# EAGLE design BLE-LORA-Relay (EAGLE 8.6.0)
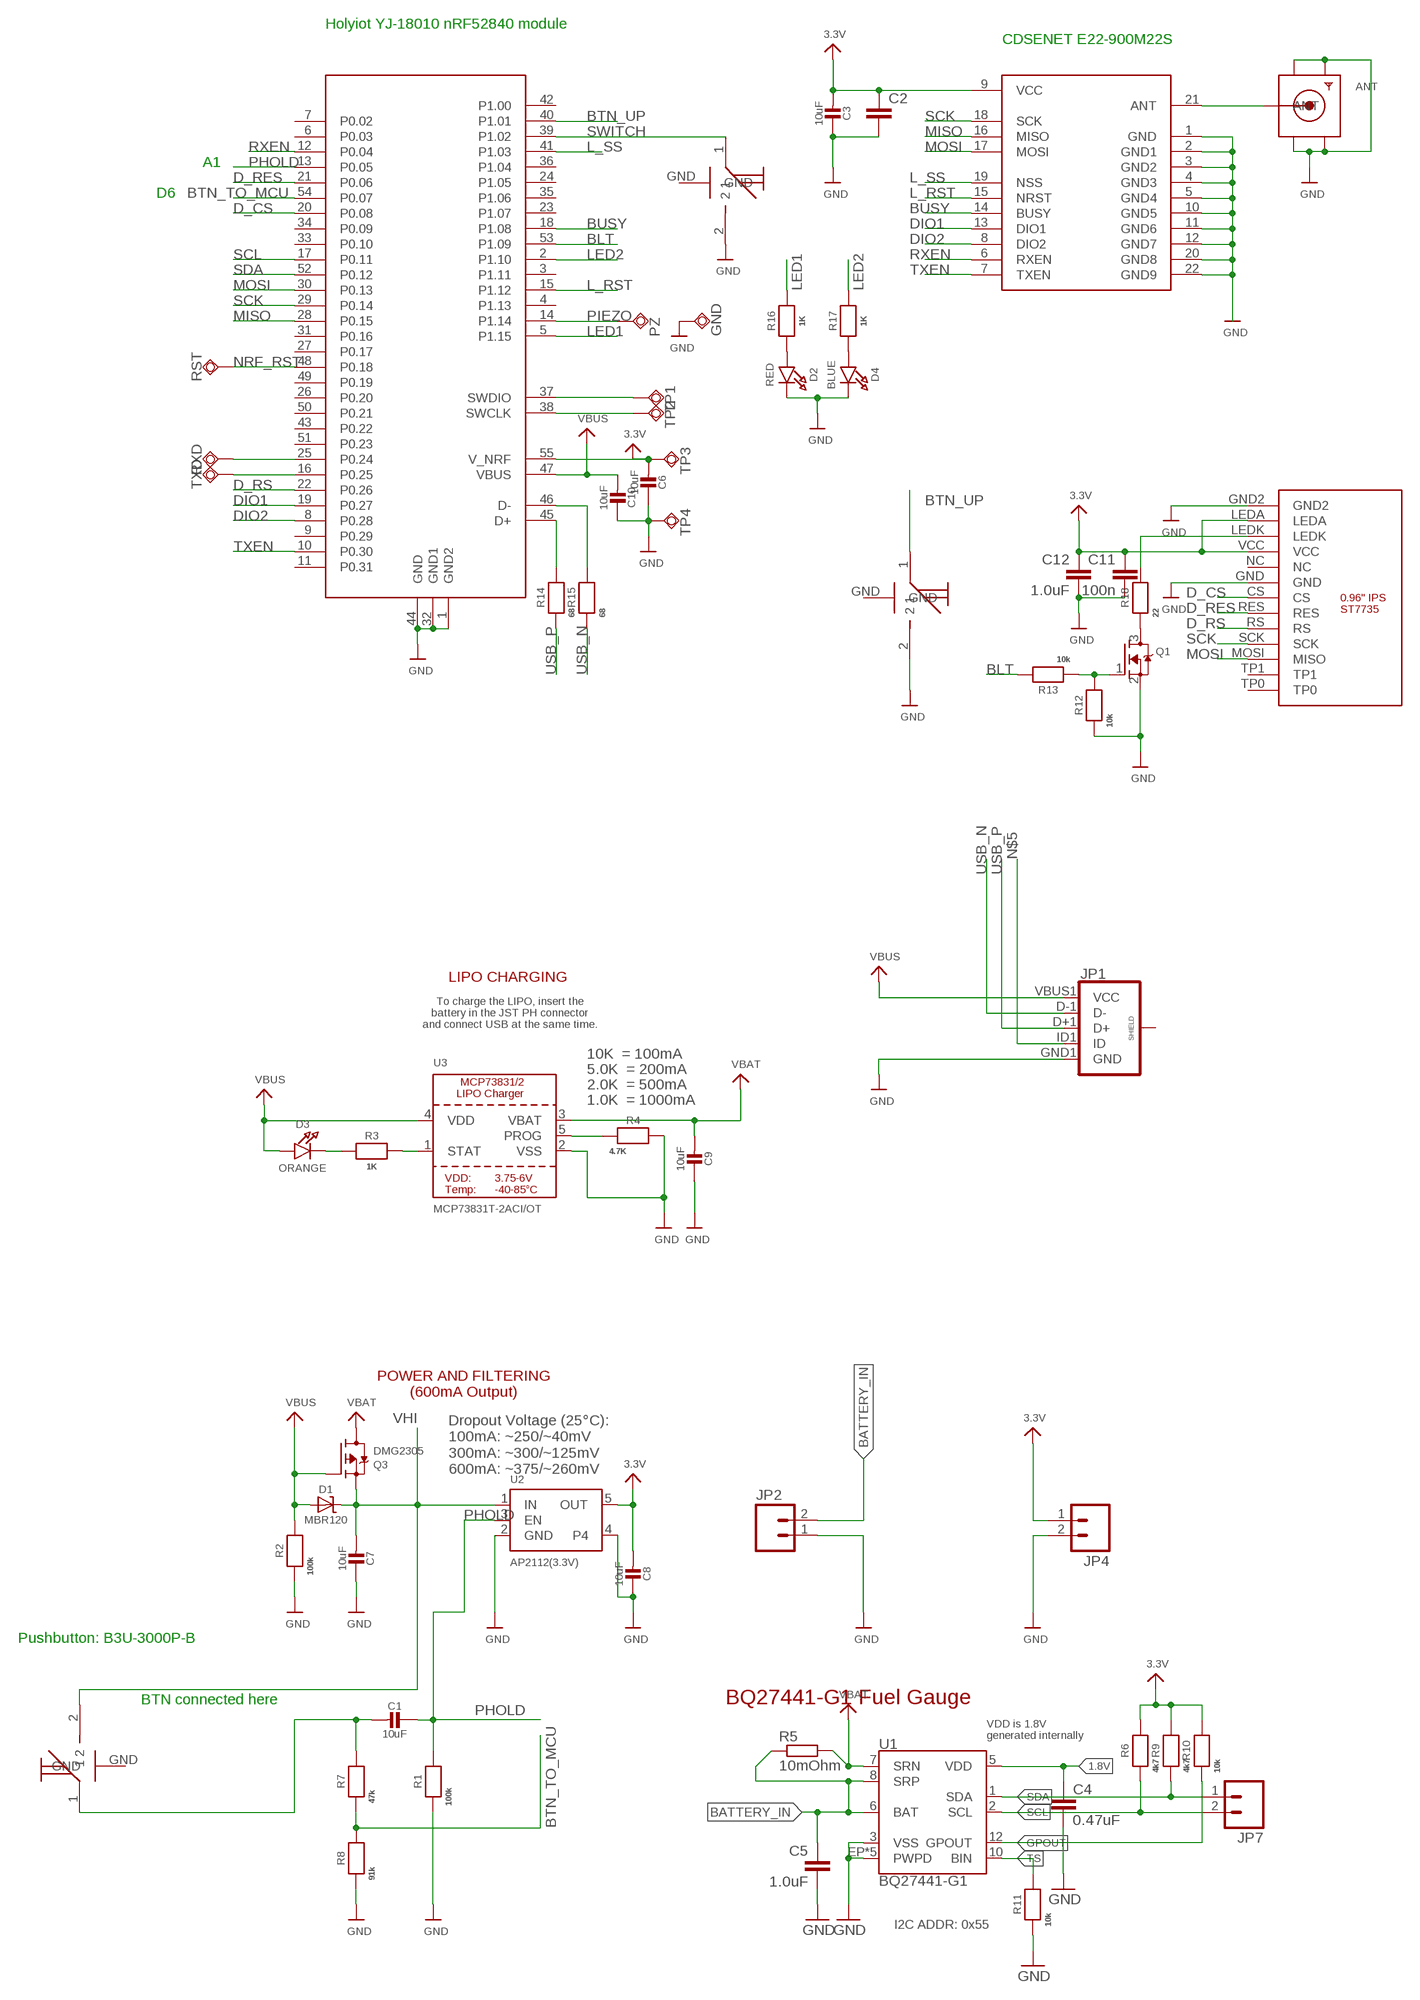
[diagram p0: schematic, sheet 1]

## Parts
ANT  SMACONNECTOR_EDGE  [SMA_EDGELAUNCH]
C1  10uF  CAP_CERAMIC0805-NOOUTLINE  [0805-NO]
C2  C-EUC1206  [C1206]
C3  10uF  CAP_CERAMIC0805-NOOUTLINE  [0805-NO]
C4  0.47uF  CAP0603-CAP  [0603-CAP]
C5  1.0uF  1.0UF-16V-10%(0603)  [0603-CAP]
C6  10uF  CAP_CERAMIC0805-NOOUTLINE  [0805-NO]
C7  10uF  CAP_CERAMIC0805-NOOUTLINE  [0805-NO]
C8  10uF  CAP_CERAMIC0805-NOOUTLINE  [0805-NO]
C9  10uF  CAP_CERAMIC0805-NOOUTLINE  [0805-NO]
C10  10uF  CAP_CERAMIC0805-NOOUTLINE  [0805-NO]
C11  100n  1.0UF-16V-10%(0603)  [0603-CAP]
C12  1.0uF  1.0UF-16V-10%(0603)  [0603-CAP]
D1  MBR120  DIODE-SCHOTTKYSOD-123  [SOD-123]
D2  RED  LED0805_NOOUTLINE  [CHIPLED_0805_NOOUTLINE]
D3  ORANGE  LED0805_NOOUTLINE  [CHIPLED_0805_NOOUTLINE]
D4  BLUE  LED0805_NOOUTLINE  [CHIPLED_0805_NOOUTLINE]
GND  TPSQTP13R  [TP13R]
JP1  USB_MICROB_PLUGCONN-11752  [USB-B-MICRO-SMD_V03]
JP2  M02PTH  [1X02]
JP4  M02PTH  [1X02]
JP7  M02PTH  [1X02]
PZ  TPSQTP13R  [TP13R]
Q1  MOSFET-NREFLOW  [SOT23]
Q3  DMG2305  MOSFET-P  [SOT23-R]
R1  100k  RESISTOR_0603_NOOUT  [0603-NO]
R2  100k  RESISTOR_0603_NOOUT  [0603-NO]
R3  1K  RESISTOR_0603_NOOUT  [0603-NO]
R4  4.7K  RESISTOR_0603_NOOUT  [0603-NO]
R5  10mOhm  R-EU_R0805  [R0805]
R6  4k7  RESISTOR_0603_NOOUT  [0603-NO]
R7  47k  RESISTOR_0603_NOOUT  [0603-NO]
R8  91k  RESISTOR_0603_NOOUT  [0603-NO]
R9  4k7  RESISTOR_0603_NOOUT  [0603-NO]
R10  10k  RESISTOR_0603_NOOUT  [0603-NO]
R11  10k  RESISTOR_0603_NOOUT  [0603-NO]
R12  10k  RESISTOR_0603_NOOUT  [0603-NO]
R13  10k  RESISTOR_0603_NOOUT  [0603-NO]
R14  68  RESISTOR_0603_NOOUT  [0603-NO]
R15  68  RESISTOR_0603_NOOUT  [0603-NO]
R16  1K  RESISTOR_0603_NOOUT  [0603-NO]
R17  1K  RESISTOR_0603_NOOUT  [0603-NO]
R18  22  RESISTOR_0603_NOOUT  [0603-NO]
RST  TPSQTP13R  [TP13R]
RXD  TPSQTP13R  [TP13R]
TP1  TPSQTP13R  [TP13R]
TP2  TPSQTP13R  [TP13R]
TP3  TPSQTP13R  [TP13R]
TP4  TPSQTP13R  [TP13R]
TXD  TPSQTP13R  [TP13R]
U1  BQ27441-G1  [PDSO-N12]
U2  AP2112(3.3V)  VREG_SOT23-5  [SOT23-5]
U3  MCP73831T-2ACI/OT  MCP73831/2  [SOT23-5]
U$14  NRF52840  [NRF52840MOD]
U$15  SX1292-EBYTE  [SX1262_EBYTE]
U$16  0.96_IPS  [0.96_IPS]
U$17  B3U-3100P-B  [B3U-3100P-B]
U$19  B3U-3100P-B  [B3U-3100P-B]
U$20  B3U-3100P-B  [B3U-3100P-B]

## Nets
1.8V: C4.1 U1.5(VDD)
3.3V [USB]: C2.1 C3.2 C6.2 C8.2 C11.1 C12.1 JP4.1 R6.2 R9.2 R10.2 TP3.TP U2.5(OUT) U$14.55(V_NRF) U$15.9(VCC) U$16.LEDA U$16.VCC
B_IN: C1.2 R7.2 U$17.1
BATTERY_IN: C5.1 JP2.2 R5.1 U1.6(BAT) U1.8(SRP)
BLT: R13.2 U$14.53(P1.09)
BTN_TO_MCU: R7.1 R8.2 U$14.54(P0.07)
BTN_UP: U$14.40(P1.01) U$20.1
BUSY: U$14.18(P1.08) U$15.14(BUSY)
D_CS: U$14.20(P0.08) U$16.CS
D_RES: U$14.21(P0.06) U$16.RES
D_RS: U$14.22(P0.26) U$16.RS
DIO1: U$14.19(P0.27) U$15.13(DIO1)
DIO2: U$14.8(P0.28) U$15.8(DIO2)
GND: ANT.GND@1(GND4) ANT.GND@2(GND3) ANT.GND@3(GND2) ANT.GND@4(GND1) C2.2 C3.1 C4.2 C5.2 C6.1 C7.1 C8.1 C9.1 C10.1 C11.2 C12.2 D2.C D4.C GND.TP JP1.GND1(GND) JP2.1 JP4.2 Q1.2(S) R1.1 R2.1 R4.2 R8.1 R11.1 R12.1 TP4.TP U1.3(VSS) U1.EP1(PWPD) U1.EP2(PWPD) U1.EP3(PWPD) U1.EP4(PWPD) U1.EP(PWPD) U2.2(GND) U2.4 U3.2(VSS) U$14.1(GND2) U$14.32(GND1) U$14.44(GND) U$15.1(GND) U$15.2(GND1) U$15.3(GND2) U$15.4(GND3) U$15.5(GND4) U$15.10(GND5) U$15.11(GND6) U$15.12(GND7) U$15.20(GND8) U$15.22(GND9) U$16.GND U$16.GND2 U$19.2 U$20.2
GPOUT: R10.1 U1.12(GPOUT)
L_RST: U$14.15(P1.12) U$15.15(NRST)
L_SS: U$14.41(P1.03) U$15.19(NSS)
LED1: R16.2 U$14.5(P1.15)
LED2: R17.2 U$14.2(P1.10)
MISO: U$14.28(P0.15) U$15.16(MISO)
MOSI: U$14.30(P0.13) U$15.17(MOSI) U$16.MOSI(MISO)
N$1: D3.C R3.1
N$2: Q1.1(G) R12.2 R13.1
N$3: ANT.P(ANT) U$15.21(ANT)
N$4: R18.2 U$16.LEDK
N$5: JP1.ID1(ID)
N$6: R14.2 U$14.45(D+)
N$7: R15.2 U$14.46(D-)
N$9: RXD.TP U$14.25(P0.24)
N$10: TXD.TP U$14.16(P0.25)
N$11: R3.2 U3.1(STAT)
N$12: R4.1 U3.5(PROG)
N$13: D2.A R16.1
N$14: D4.A R17.1
N$15: Q1.3(D) R18.1
NRF_RST: RST.TP U$14.48(P0.18)
PHOLD: C1.1 R1.2 U2.3(EN) U$14.13(P0.05)
PIEZO: PZ.TP U$14.14(P1.14)
RXEN: U$14.12(P0.04) U$15.6(RXEN)
SCK: U$14.29(P0.14) U$15.18(SCK) U$16.SCK
SCL: JP7.2 R6.1 U1.2(SCL) U$14.17(P0.11)
SDA: JP7.1 R9.1 U1.1(SDA) U$14.52(P0.12)
SWCLK: TP2.TP U$14.38(SWCLK)
SWDIO: TP1.TP U$14.37(SWDIO)
SWITCH: U$14.39(P1.02) U$19.1
TS: R11.2 U1.10(BIN)
TXEN: U$14.10(P0.30) U$15.7(TXEN)
USB_N: JP1.D-1(D-) R15.1
USB_P: JP1.D+1(D+) R14.1
VBAT [USB]: C9.2 Q3.3(D) R5.2 U1.7(SRN) U3.3(VBAT)
VBUS [USB]: C10.2 D1.A D3.A JP1.VBUS1(VCC) Q3.1(G) R2.2 U3.4(VDD) U$14.47(VBUS)
VHI [USB]: C7.2 D1.C Q3.2(S) U2.1(IN) U$17.2
Unconnected: JP1.SHIELD1(SHIELD) JP1.SHIELD2(SHIELD) JP1.SHIELD3(SHIELD) U$14.3(P1.11) U$14.4(P1.13) U$14.6(P0.03) U$14.7(P0.02) U$14.9(P0.29) U$14.11(P0.31) U$14.23(P1.07) U$14.24(P1.05) U$14.26(P0.20) U$14.27(P0.17) U$14.31(P0.16) U$14.33(P0.10) U$14.34(P0.09) U$14.35(P1.06) U$14.36(P1.04) U$14.42(P1.00) U$14.43(P0.22) U$14.49(P0.19) U$14.50(P0.21) U$14.51(P0.23) U$16.NC U$16.TP0 U$16.TP1 U$17.GND U$19.GND U$20.GND

## Notes on the sheet
- Holyiot YJ-18010 nRF52840 module
- CDSENET E22-900M22S
- A1
- D6
- LIPO CHARGING
- To charge the LIPO, insert the
  battery in the JST PH connector
  and connect USB at the same time.
- 10K  = 100mA
- 5.0K  = 200mA
- 2.0K  = 500mA
- 1.0K  = 1000mA
- POWER AND FILTERING
  (600mA Output)
- Dropout Voltage (25°C):
  100mA: ~250/~40mV
  300mA: ~300/~125mV
  600mA: ~375/~260mV
- Pushbutton: B3U-3000P-B
- BQ27441-G1 Fuel Gauge
- BTN connected here
- VDD is 1.8V
  generated internally
- I2C ADDR: 0x55

## Library data of the parts
ANT = adafruit:SMACONNECTOR: SMA Connector 90° DIP SMA Connector, 50 Ohm (4UConnector: 07259)
C1 C3 C6-C10 = microbuilder:CAP_CERAMIC: Ceramic Capacitors For new designs, use the packages preceded by an '_' character since they are more reliable: The following footprints should be used on most boards: _0402 - Standard footprint for regular board layouts _0603 - Standard footprint for regular board layouts _0805 - Standard footprint for regular board layouts _1206 - Standard footprint for regular board layouts For extremely tight-pitch boards where space is at a premium, the following 'micro-pitch' footprints can be used (smaller pads, no silkscreen outline, etc.): _0402MP - Micro-pitch footprint for very dense/compact boards _0603MP - Micro-pitch footprint for very dense/compact boards _0805MP - Micro-pitch footprint for very dense/compact boards _1206MP - Micro-pitch footprint for very dense/compact boards
C2 = rcl:C-EU: CAPACITOR, European symbol
C4 = SparkFun-Capacitors:CAP: Capacitor Standard 0603 ceramic capacitor, and 0.1" leaded capacitor.; PROD_ID: CAP-13216
C5 C12 = SparkFun-Capacitors:1.0UF-16V-10%(0603): CAP-00868; PROD_ID: CAP-00868
C11 = SparkFun-Capacitors:1.0UF-16V-10%(0603): CAP-00868; PROD_ID: CAP-00868; VALUE: 1.0uF
D1 = microbuilder:DIODE-SCHOTTKY
D2-D4 = microbuilder:LED: LED 0603 - 0603 Surface Mount Package 2mA: Green LED - Low Power (3.9mcd, 2ma, 1.7Vf) - Digikey: 475-2709-2-ND Orange LED - Low Power (9.8mcd, 2ma, 1.8Vf) - Digikey: 475-1194-2-ND Red LED - Low Power (5mcd, 2ma, 1.8Vf) - Digikey: 475-1195-2-ND Yellow LED - Low Power (7mcd, 2ma, 1.8Vf) - Digikey: 475-1196-2-ND 5mA: Blue LED - Low Power (17mcd, 5ma, 2.9Vf) - Digikey: LNJ937W8CRACT-ND 0805 - 0805 Surface Mount Package 2mA: Red LED (8.8mcd, 2mA, 1.8Vf, Clear) - Low Power [Digikey: 475-2510-1-ND] Green LED (5mcd, 2mA, 1.8Vf, Clear) - Low Power [Digikey: 475-2730-1-ND] Yellow LED (11.3mcd, 2mA, 1.8Vf, Clear) - Low Power [Digikey: 475-2555-1-ND] 20mA: Red LED (104mcd, 20mA, Diffused) - LS R976 [Digikey: 475-1278-6-ND] Red LED (12mcd, 20mA, 2.0Vf, Clear) - APT2012EC [Digikey: 754-1128-1-ND] Green LED (15mcd, 20mA, 2.2Vf, Clear) - APT2012GC [Digikey: 754-1131-1-ND] Orange LED (160mcd, 20mA, 2.1Vf, Clear) - APT2012SECK [Digikey: 754-1130-1-ND] 1206 - 1206 Surface Mount Package Green LED (26mcd, 20mA, Diffused) - LG N971 [Digikey: 475-1407-6-ND] Red LED (15mcd, 20mA, Diffused) - LH N974 [Digikey: 475-1416-6-ND] Cree - Cree High-Power Surface Mount LEDs XPEBWT-L1-0000-00D50 - White 111lm 350mA 2.9Vf 6200K 110° XTEAWT-00-0000-00000LEE3 - White 114lm 350mA 2.85Vf 5000K 115° Everlight - Everlight 45-21 Series Surface Mount LEDs 45-21/QK2C-B2832AC2CB2/2T - Warm White 2000mcd 20mA 3.25Vf 3050K 120° 45-21/LK2C-B38452C4CB2/2T - Nuetral White 2000mcd 20mA 3.25Vf 4150K 120° 45-21/LK2C-B50634C6CB2/2T - Cold White 2200mcd 20mA 3.25Vf 5650K 120° PLCC2 Reverse Mount LS T77K-J1L2-1-0-2-R18-Z - Red 11.25mcd 2mA 1.8Vf 630nm 120° LO T77K-L1M2-24-Z - Orange 19.6mcd 2mA 1.8Vf 606nm 120° LY T77K-K2M1-26-Z - Yellow 15.7mcd 2mA 1.8Vf 587nm 120°
GND PZ RST RXD TP1-TP4 TXD = testpad:TPSQ: Test pad
JP1 = SparkFun-Connectors:USB_MICROB_PLUG: USB Micro-B connectors Some male, some female. Watch your step!; PROD_ID: CONN-11752
JP2 JP4 JP7 = SparkFun-Connectors:M02: Standard 2-pin 0.1" header. Use with - straight break away headers ( PRT-00116) - right angle break away headers (PRT-00553) - swiss pins (PRT-00743) - machine pins (PRT-00117) - female headers (PRT-00115) Molex polarized connector foot print use with: PRT-08233 with associated crimp pins and housings. 2.54_SCREWTERM for use with PRT-10571. 3.5mm Screw Terminal footprints for PRT-08084 5mm Screw Terminal footprints for use with PRT-08432
Q1 = adafruit:MOSFET-N: N-Channel Mosfet 2N7002E - 60V 260mA SOT23 [Digikey: 2N7002ET1GOSTR-ND] - REEL BSH103 - 30V 850mA SOT23 [Digikey: 568-5013-1-ND]
Q3 = microbuilder:MOSFET-P: P-Channel Mosfet LEGEND VDS: Voltage Drain-Source ID: Drain Current RDS(ON): Drain-Source On-State Resistance VGS(TH): Gate-Source Threshold Voltage CISS: Drain-Source Input Capacitance SOT-23 Name VDS ID RDS(ON) VGS(TH) CISS Order Number IRLML5103 30V 760mA 600 mOhm -- 75pF @ 25V Digikey: IRLML5103PBFCT-ND IRLML6401 12V 4.3A 50 mOhm 950mV @ 250µA 830pF @ 10V Digikey: IRLML6401PBFTR-ND NTR0202PL 20V 400mA 800 mOhm 2.3V @ 250uA 70pF @ 5V Digikey: NTR0202PLT1GOSTR-ND NTR4101PT1G 20V 1.8A 85 mOhm 1.2V @ 250uA 675pF @ 10V Digikey: NTR4101PT1GOSCT-ND DMP2004K 20V 600mA 900 mOhm 1V @ 250uA 175pF @ 16V Digikey: DMP2004KDICT-ND PMV65XP 20V 3.9A 76 mOhm 950mV @ 1mA 725pF @ 20V Digikey: 568-2358-2-ND TO-252 Name VDS ID RDS(ON) VGS(TH) CISS Order Number AOD417 30V 25A 34 mOhm 3V @ 250µA 920pF @ 15V Digikey: 785-1106-2-ND PowerPak Name VDS ID RDS(ON) VGS(TH) CISS Order Number AON7401 30V 12A 14 mOhm 3V @ 250µA 2600pF @ 15V Digikey: 785-1302-1-ND
R1-R4 R6-R18 = microbuilder:RESISTOR: Resistors For new designs, use the packages preceded by an '_' character since they are more reliable: The following footprints should be used on most boards: _0402 - Standard footprint for regular board layouts _0603 - Standard footprint for regular board layouts _0805 - Standard footprint for regular board layouts _1206 - Standard footprint for regular board layouts For extremely tight-pitch boards where space is at a premium, the following 'micro-pitch' footprints can be used (smaller pads, no silkscreen outline, etc.): _0402MP - Micro-pitch footprint for very dense/compact boards _0603MP - Micro-pitch footprint for very dense/compact boards _0805MP - Micro-pitch footprint for very dense/compact boards _1206MP - Micro-pitch footprint for very dense/compact boards
R5 = rcl:R-EU_: RESISTOR, European symbol
U1 = battery-management-temp:BQ27441-G1; PROD_ID: IC-13220
U2 = microbuilder:VREG_SOT23-5: SOT23-5 Fixed Voltage Regulators Part Current Out V Out V In V Dropout θJA (°C/W) TJ (°C) Digikey Part No. ADP121 150mA 3.3V 3.4-5.5V 0.09V @ 150mA -- -- ADP121-AUJZ33R7CT-ND ADP121 150mA 3.0V 3.1-5.5V 0.09V @ 150mA -- -- ADP121-AUJZ30R7CT-ND ADP122 300mA 3.3V 3.4-5.5V 0.085V @ 300mA -- -- ADP122AUJZ-3.3-R7CT-ND ADP1712 300mA 3.3V 3.5-5.5V 0.17V @ 300mA -- -- ADP1712AUJZ-3.3-R7TR-ND AP7311 (Low Cost) 150mA 3.3V 3.5-6V 0.15V @ 150mA -- -- AP7311-33WG-7DICT-ND LD39015M18R 150mA 1.8V 1.9V-5.5V 0.08V @ 100mA -- -- 497-6977-1-ND LP2985A-33DBVR 150mA 3.3V 3.3-16V 0.28V @ 150mA 206 150 296-18479-1-ND MCP1824T-3302E/OT 300mA 3.3V 3.5V-6V 0.2V @ 300mA -- -- MCP1824T-3302E/OTCT-ND MIC5205-2.5YM5 TR 150mA 2.5V 2.7-16V 0.165V @ 150mA -- -- 576-1257-2-ND MIC5205-3.0YM5 TR 150mA 3.0V 3.2V-16V 0.165V @ 150mA -- -- 576-1258-2-ND MIC5205-3.3YM5 TR 150mA 3.3V 3.5V-16V 0.165V @ 150mA -- -- 576-1259-2-ND TPS780330220 150mA 3.3V+2.2V 3.6-5.5V 250mV Max -- -- 296-23332-1-ND TDA3663/N1,135 100mA 3.3V 3.5-45V 0.18V @ 50mA -- -- 568-5343-1-ND Max operating temp can be calculated using θJA, TJ (max junction temperature), and power in watts. Set the "Maximum Ambient Temperature" until it reaches TJ ("Max Junction Temperature"), which is the absolute limit for safe use of the regulator: Heat Sink Temperature Calculator <http://www.daycounter.com/Calculators/Heat-Sink-Temperature-Calculator.phtml> For example, With 12V source into a 3.3V LP2985 and a 30mA load, we are dissipating (12V-3.3V) * 0.03A = 0.261W. With a θJA of 206 °C/W, a TJ of 150°C, and 261mW we can safely use the chip without a heat sink up to 75°C (=147.1°C Junction Temperature).
U3 = microbuilder:MCP73831/2: MCP73831/2 LIPO Charger VDD: 3.75 - 6V Temp -40 - 85°C Programmable Charge Rate: 15-500mA NOTE: STAT is a tri-state logic output on the MCP73831 and an open-drain output on the MCP73832. SOT23-5 with 4.2V output and tri-state logic on STAT = MCP73831T-2ACI/OT
U$14 = nrf52840mod:NRF52840
U$15 = sx1262-EBYTE:SX1292-EBYTE
U$16 = 0.96_IPS:0.96_IPS
U$17 U$19 U$20 = B3U-3100P-B:B3U-3100P-B

## Net classes
1 USB: width 0.406 mm

## Board
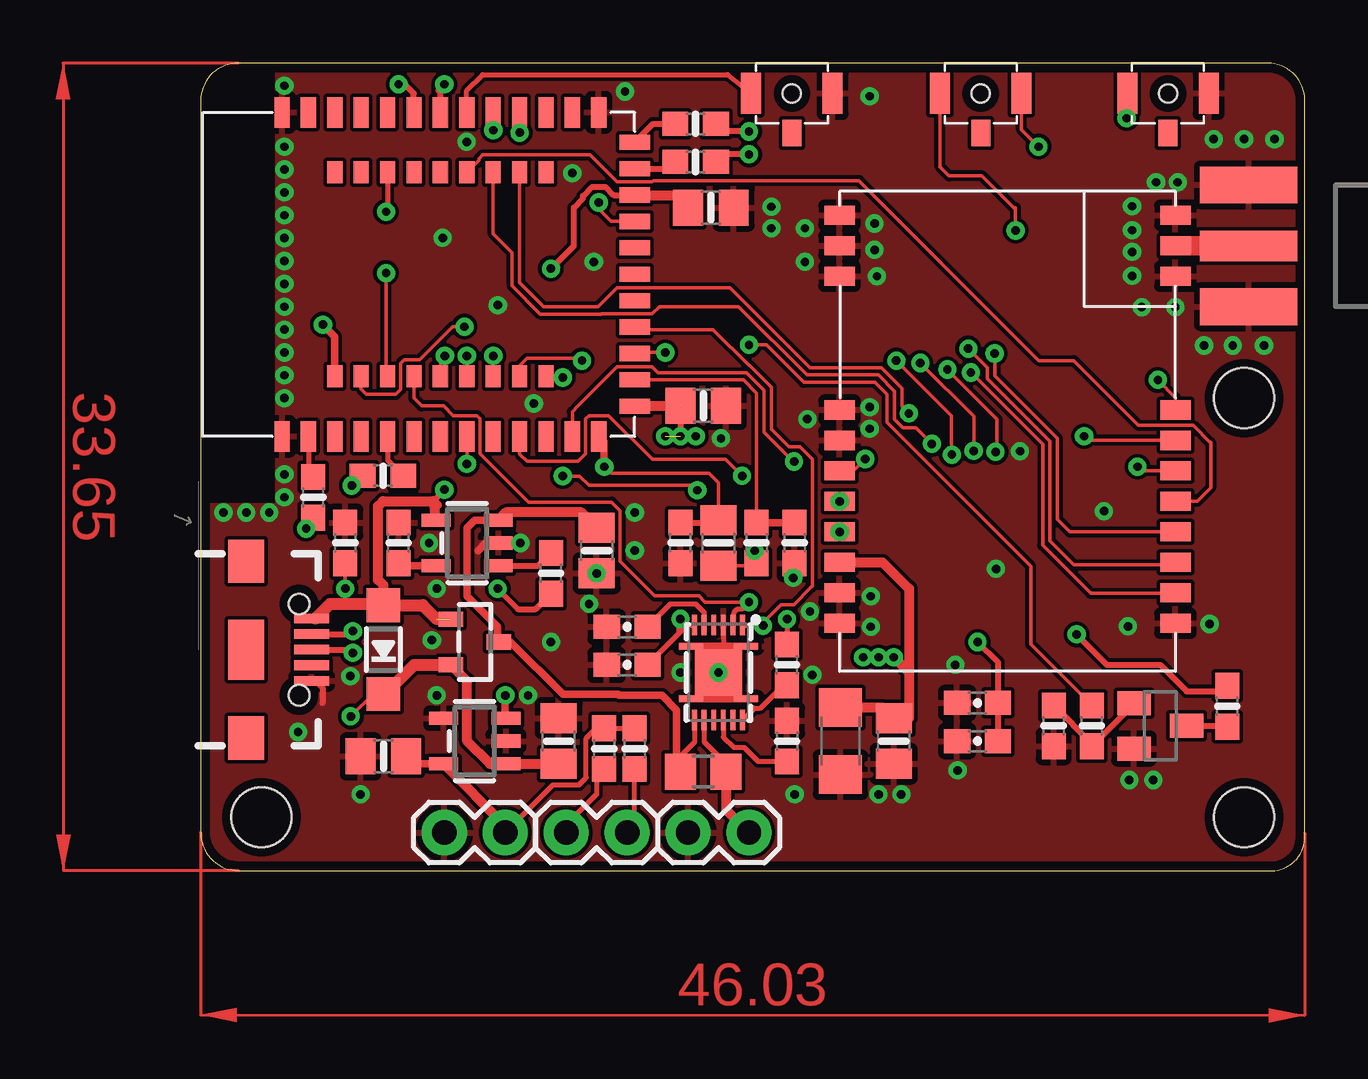
[diagram p1: board, top side]
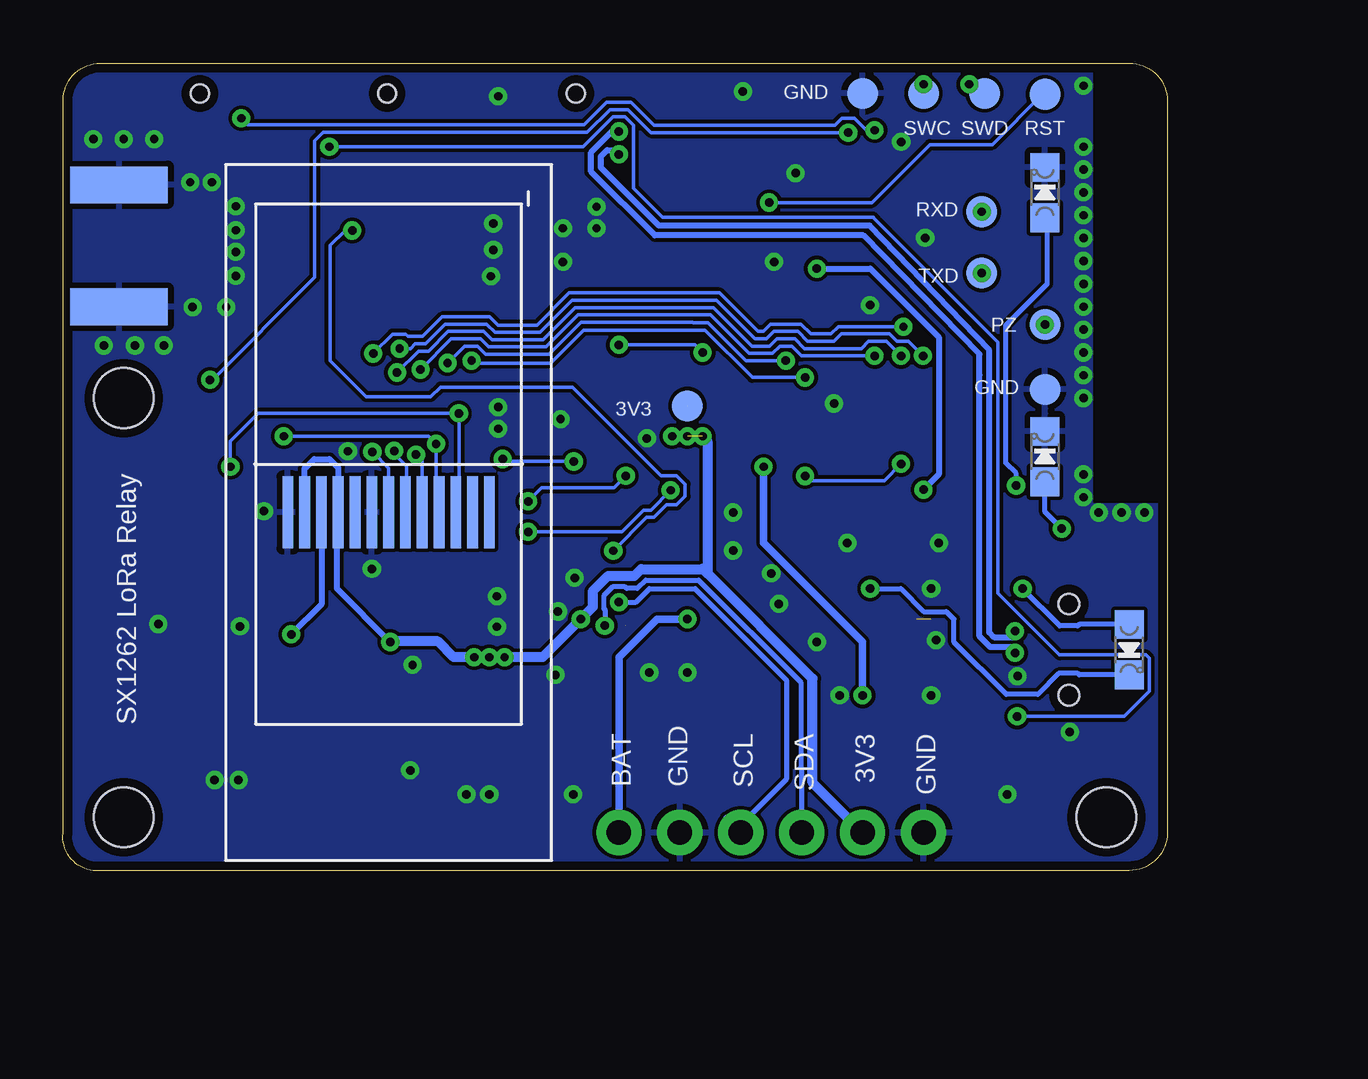
[diagram p2: board, bottom side, seen from below]

Size 46.03 x 33.64 mm. Coordinates in mm from the lower left corner, seen from the top.
Outline: 44.48,33.64 1.57,33.64 arc90 0,32.07 0,1.59 arc90 1.59,0 44.77,0 arc90 46.02,1.57 46.02,32.1 arc90 44.48,33.64
Copper layers (1*16): Top 0.035mm / dielectric 1.5mm / Bottom 0.035mm
Design rules "default *": minimum track width 6mil, minimum drill 0.35mm, track to track 6mil, track to pad 6mil, pad to pad 6mil, via to via 6mil, smd to smd 6mil, copper to edge 15mil, drill to drill 6mil, minimum pad ring 10mil, minimum via ring 8mil, stop-mask expansion 4mil, vias tented up to drill 20mil, thermal gap 10mil
Holes 2.5 mm at 2.54,2.22 43.5,2.22 43.5,19.68

### Footprints (pad centres in the part's own frame; a part is rotated, then mirrored left to right if it is on the bottom)
SMA_EDGELAUNCH = smd 4.064 x 1.524: GND@1 2.032,-2.54; GND@2 2.032,2.54 | smd 4.064 x 1.524 bottom: GND@3 2.032,2.54; GND@4 2.032,-2.54 | smd 4.064 x 1.27: P 2.032,0
0805-NO = smd 1.24 x 1.5: 1 -0.95,0; 2 0.95,0
C1206 = smd 1.6 x 1.8: 1 -1.4,0; 2 1.4,0
0603-CAP = smd 1.1 x 1: 1 -0.85,0; 2 0.85,0
SOD-123 = smd 1.4 x 1.4: A 1.85,0; C -1.85,0
CHIPLED_0805_NOOUTLINE = smd 1.2 x 1.2: A 0,-1.05; C 0,1.05
TP13R = smd 1.3 x 1.3: TP 0,0
USB-B-MICRO-SMD_V03 = smd 1.45 x 0.4: D+1 2.725,0; D-1 2.725,0.65; GND1 2.725,-1.3; ID1 2.725,-0.65; VBUS1 2.725,1.3 | smd 1.5 x 1.8: SHIELD1 0,3.685; SHIELD2 0,-3.685 | smd 1.5 x 2.5: SHIELD3 0,0 | hole 0.85: 2.2,1.9; 2.2,-1.9
1X02 = drill 1.016 pad 1.88: 1 0,0; 2 2.54,0
SOT23 = smd 1 x 1.4: 1 -0.95,-1.1; 2 0.95,-1.1; 3 0,1.1
SOT23-R = smd 0.635 x 1.016: 1 -0.95,-1; 2 0.95,-1; 3 0,1
0603-NO = smd 1.075 x 1: 1 -0.85,0; 2 0.85,0
R0805 = smd 1.3 x 1.5: 1 -0.95,0; 2 0.95,0
PDSO-N12 = smd 0.2 x 0.85: 1 -1,-1.975; 2 -0.6,-1.975; 3 -0.2,-1.975; 4 0.2,-1.975; 5 0.6,-1.975; 6 1,-1.975; 7 1,1.975; 8 0.6,1.975; 9 0.2,1.975; 10 -0.2,1.975; 11 -0.6,1.975; 12 -1,1.975 | smd 1.95 x 1.95: EP 0,0 | smd 1 x 0.25: EP1 -1.15,1.1; EP2 -1.15,-1.1; EP3 1.15,-1.1; EP4 1.15,1.1
SOT23-5 = smd 0.55 x 1.2: 1 -0.95,-1.3; 2 0,-1.3; 3 0.95,-1.3; 4 0.95,1.3; 5 -0.95,1.3
NRF52840MOD = smd 1.27 x 0.635: 1 0,14.7; 2 0,13.6; 3 0,12.5; 4 0,11.4; 5 0,10.3; 6 0,9.2; 7 0,8.1; 8 0,7; 9 0,5.9; 10 0,4.8; 11 0,3.7; 12 0,2.6; 13 0,1.5; 32 13.5,14.7; 33 13.5,13.6; 34 13.5,12.5; 35 13.5,11.4; 36 13.5,10.3; 37 13.5,9.2; 38 13.5,8.1; 39 13.5,7; 40 13.5,5.9; 41 13.5,4.8; 42 13.5,3.7; 43 13.5,2.6; 44 13.5,1.5; P$7 0,8.1; P$32 13.5,8.1 | smd 0.9 x 0.635: 14 2.5,12.5; 15 2.5,11.4; 16 2.5,10.3; 17 2.5,9.2; 18 2.5,8.1; 19 2.5,7; 20 2.5,5.9; 21 2.5,4.8; 22 2.5,3.7; 23 11,12.5; 24 11,11.4; 25 11,10.3; 26 11,9.2; 27 11,8.1; 28 11,7; 29 11,5.9; 30 11,4.8; 31 11,3.7 | smd 0.635 x 1.27: 45 12.25,0; 46 11.15,0; 47 10.05,0; 48 8.95,0; 49 7.85,0; 50 6.75,0; 51 5.65,0; 52 4.55,0; 53 3.45,0; 54 2.35,0; 55 1.25,0
SX1262_EBYTE = smd 1.27 x 0.8: 1 14,0; 2 14,1.27; 3 14,2.54; 4 14,8.11; 5 14,9.38; 6 14,10.65; 7 14,11.92; 8 14,13.19; 9 14,14.46; 10 14,15.73; 11 14,17; 12 0,17; 13 0,15.73; 14 0,14.46; 15 0,13.19; 16 0,11.92; 17 0,10.65; 18 0,9.38; 19 0,8.11; 20 0,2.54; 21 0,1.27; 22 0,0
0.96_IPS = smd 3 x 0.45: CS 0,4.2; GND 0,4.9; GND2 0,8.4; LEDA 0,7.7; LEDK 0,7; MOSI 0,1.4; NC 0,5.6; RES 0,3.5; RS 0,2.8; SCK 0,2.1; TP0 0,0; TP1 0,0.7; VCC 0,6.3
B3U-3100P-B = smd 0.835 x 1.7: 1 -1.7,0; 2 1.7,0 | smd 0.8 x 1.1: GND 0,-1.65 | hole 0.75: 0,0

### Placement (x,y rotation side)
ANT  45.72,26.04 180 top
C1  21.59,13.65 270 top
C2  26.67,5.4 270 top
C3  28.89,5.4 90 top
C4  17.78,10.16 180 top
C5  17.78,8.57 180 top
C6  20.95,19.37 180 top
C7  14.92,5.4 270 top
C8  7.62,4.76 0 top
C9  16.51,13.33 90 top
C10  21.27,27.62 180 top
C11  32.38,6.99 180 top
C12  32.38,5.4 180 top
D1  7.62,9.21 90 top
D2  5.1,28.25 0 bottom
D3  1.59,9.21 180 bottom
D4  5.1,17.25 0 bottom
GND  5.1,20.05 0 bottom
JP1  1.91,9.21 0 top
JP2  20.32,1.59 0 top
JP4  12.7,1.59 180 top
JP7  15.24,1.59 0 top
PZ  5.1,22.75 0 bottom
Q1  40.01,6.03 270 top
Q3  11.43,9.52 270 top
R1  20,13.65 90 top
R2  6.03,13.65 270 top
R3  14.61,12.38 90 top
R4  8.26,13.65 90 top
R5  20.95,4.13 180 top
R6  18.1,5.08 90 top
R7  23.18,13.65 270 top
R8  24.77,13.65 90 top
R9  16.83,5.08 90 top
R10  24.45,8.57 90 top
R11  24.45,5.4 270 top
R12  35.56,6.03 90 top
R13  37.15,6.03 90 top
R14  20.64,31.12 180 top
R15  20.64,29.53 180 top
R16  7.6,16.45 0 top
R17  4.7,15.55 90 top
R18  42.8,6.85 90 top
RST  5.1,32.35 0 bottom
RXD  7.73,27.45 0 bottom
TP1  7.62,32.38 0 bottom
TP2  10.16,32.38 0 bottom
TP3  20,19.37 0 bottom
TP4  12.7,32.38 0 bottom
TXD  7.73,24.89 0 bottom
U1  21.59,8.25 180 top
U2  11.43,5.4 90 top
U3  11.11,13.65 90 top
U$14  18.1,18.1 90 top
U$15  40.64,27.3 180 top
U$16  28.26,14.92 90 bottom
U$17  32.52,32.38 0 top
U$19  24.65,32.38 0 top
U$20  40.32,32.38 0 top

### Tracks (layer width: path | path; a pad name or v marks a point on that pad's centre or on a via)
1.8V
  Top 0.203: C4.1 19.58,11.11 20.64,11.11 20.99,10.76 U1.5
3.3V  (via drill 0.35)  (2 unrouted)
  Top 0.2: JP4.1 14.69,3.58 15.78,3.58 16.07,3.87 16.07,5.51 16.51,5.94 R9.2 R6.2
  Top 0.203: v24.45,10.48 R10.2
  Top 0.254: TP3.TP v20,18.1 | v32.38,9.52 33.23,8.67 C11.1 C12.1
  Top 0.305: C8.2 8.57,4.45 U2.5
  Top 0.406: U2.5 12.7,1.88 JP4.1 | U$14.55 18.12,19.37 TP3.TP | v20,18.1 v20.64,18.1 | 29.53,8.25 v28.89,8.89 v28.26,8.89 v27.62,8.89 | 29.53,8.25 29.53,6.35 29.52,6.35 C3.2 28.44,6.8 C2.1 | U$15.9 28.43,12.84 29.53,11.75 29.53,8.25
  Bottom 0.152: 19.37,12.48 19.37,12.58
  Bottom 0.203: 12.7,2.22 JP4.1
  Bottom 0.254: U$16.LEDA 35.96,16.75 35.56,17.15 34.92,17.15 34.56,16.78 U$16.VCC 34.56,14.34 34.61,14.29 34.61,11.75 v32.38,9.52
  Bottom 0.406: JP4.1 14.78,3.67 14.78,7.99 19.17,12.38 | 19.17,12.38 19.35,12.56 | 19.35,12.56 19.37,12.58 | 19.35,12.56 21.93,12.56 22.22,12.27 22.23,12.28 23.31,12.28 23.95,11.64 23.95,10.98 v24.45,10.48 26.04,8.89 27.2,8.89 v28.26,8.89 29.74,8.89 30.4,9.55 32.36,9.55 v32.38,9.52 | v19.37,18.1 19.17,17.9 19.17,12.38
B_IN  (via drill 0.35)
  Top 0.152: C1.2 22.79,12.7 v23.09,13.33 23.09,12.89 R7.2 | 33.97,27.62 33.97,27.55 | 33.97,27.55 v33.97,26.67 | 33.97,27.55 32.57,28.95 31.2,28.95 30.82,29.33 U$17.1
  Bottom 0.152: v33.97,26.67 34.28,26.67 34.9,26.05 34.9,21.25 33.4,19.75 30.7,19.75 30.3,20.15 24.8,20.15 21.11,16.45 20.45,16.45 20.09,16.1 20.09,15.6 20.45,15.24 20.88,15.24 21.4,14.72 21.7,14.72 v23.09,13.33
BATTERY_IN  (via drill 0.35)
  Top 0.203: U1.8 20.99,5.36 21.91,4.45 | C5.1 19.95,9.89 | 19.95,9.89 20.29,10.23 U1.6 | 19.95,9.89 19.95,10.43 v20,10.48
  Top 0.254: 21.91,4.45 R5.1
  Top 0.406: R5.1 21.91,2.54 JP2.2
  Bottom 0.305: JP2.2 22.86,8.89 21.27,10.48 v20,10.48
BLT  (via drill 0.35)
  Top 0.152: v22.86,21.91 23.59,21.91 25.15,20.35 28.12,20.35 28.62,19.85 28.62,18.67 34.61,12.68 34.61,9.42 R13.2 | v19.37,21.59 18.14,21.59 U$14.53
  Bottom 0.152: v22.86,21.91 19.68,21.91 v19.37,21.59
BTN_TO_MCU
  Top 0.152: U$14.54 22.63,20.45 23.18,19.9 R7.1
  Top 0.305: R7.1 R8.2
BTN_UP  (via drill 0.35)
  Top 0.152: U$14.40 v12.2,30.85 | v38.6,31.35 38.62,31.37 U$20.1
  Bottom 0.152: v12.2,30.85 12.54,30.85 13.05,31.35 13.55,31.35 13.85,31.05 21.39,31.05 22.36,32.01 23.36,32.01 24.3,31.07 38.33,31.07 v38.6,31.35
BUSY  (via drill 0.35)
  Top 0.152: U$14.18 10,21.26 v10.18,21.45 | v32,21.75 32.8,20.95 32.8,20.49 35.41,17.89 35.41,13.74 36.4,12.75 40.54,12.75 U$15.14
  Bottom 0.152: v10.18,21.45 10.79,22.05 11.28,22.05 11.58,22.36 13.59,22.36 13.89,22.06 14.99,22.06 15.4,22.46 16.4,22.46 16.71,22.16 17.19,22.16 18.79,23.76 24.81,23.76 26.14,22.43 28.03,22.43 28.37,22.77 30.1,22.77 30.91,21.95 31.34,21.95 31.55,21.75 v32,21.75
D_CS  (via drill 0.35)
  Top 0.152: U$14.20 v12.2,21.45 | v31.13,20.88 33.2,18.81 33.2,17.45 v33.13,17.45
  Bottom 0.152: v12.2,21.45 15.24,21.45 15.65,21.85 16.15,21.85 16.45,21.55 17.44,21.55 19.04,23.15 24.56,23.15 25.89,21.82 28.28,21.82 28.62,22.16 29.85,22.16 v31.13,20.88 | v33.13,17.45 32.46,16.77 U$16.CS
D_RES  (via drill 0.35)
  Top 0.152: U$14.21 13.3,21.04 13.6,21.35 15.8,21.35 v15.9,21.25 | v30,21.15 32.23,18.92 v32.23,17.49
  Bottom 0.152: v15.9,21.25 17.57,21.25 19.14,22.82 19.77,22.82 19.8,22.85 24.43,22.85 25.77,21.51 28.41,21.51 28.75,21.85 29.29,21.85 v30,21.15 | v32.23,17.49 32.23,17.37 31.7,16.85 31.7,14.98 U$16.RES
D_RS  (via drill 0.35)
  Top 0.152: U$14.22 15.05,20.6 v15.1,20.55 | v29,21.25 31.3,18.95 31.3,17.35 v31.32,17.33
  Bottom 0.152: v15.1,20.55 17.3,20.55 19.27,22.51 24.33,22.51 25.7,21.15 28.9,21.15 v29,21.25 | v31.32,17.33 31.06,17.07 U$16.RS
DIO1  (via drill 0.35)
  Top 0.152: U$14.19 v11.1,21.45 | v32.11,20.75 35.1,17.76 35.1,13.55 37.1,11.55 40.61,11.55 U$15.13
  Bottom 0.152: v11.1,21.45 11.71,22.05 12.45,22.05 12.75,21.75 15.12,21.75 15.52,22.16 16.28,22.16 16.58,21.86 17.32,21.86 18.92,23.46 24.68,23.46 26.02,22.12 28.16,22.12 28.5,22.46 29.97,22.46 30.79,21.65 31.22,21.65 v32.11,20.75
DIO2  (via drill 0.35)
  Top 0.152: U$14.8 v11.1,16.95 | v20.7,15.85 20.5,16.05 16.2,16.05 15.81,16.44 v15.1,16.44
  Bottom 0.152: v11.1,16.95 11.8,16.25 14.91,16.25 v15.1,16.44 | U$15.8 22.73,14.12 21.83,15.02 21.52,15.02 v20.7,15.85
  other vias: 26.64,14.12
GND  (via drill 0.35)
  Top 0.2: U1.EP1 22.05,7.15 21.59,7.62 | 21.59,7.62 U1.EP 21.59,8.89 | U1.EP4 21.12,7.15 21.59,7.62 | U1.EP2 22.05,9.35 21.75,9.05 21.59,8.89 | U1.EP3 21.12,9.35 21.59,8.89
  Top 0.203: U1.3 21.79,9.09 21.75,9.05
  Top 0.254: JP1.GND1 4.79,7.91 5.08,7.62 5.08,6.99
  Top 0.305: U3.2 11.89,13.65 11.57,13.33
  other vias: 21.59,8.25 9.84,7.3 13.65,7.3 13.34,13.65 9.53,13.65 14.61,9.52 18.1,13.33 16.51,12.38 16.19,11.11 25.4,10.79 6.67,3.18 9.84,11.75 18.1,14.92 20,8.25 24.77,3.18 3.49,19.68 3.49,16.51 3.49,30.16 3.49,32.7 3.49,20.64 3.49,21.59 3.49,22.54 3.49,23.5 3.49,24.45 3.49,25.4 3.49,26.35 3.49,27.3 3.49,28.26 3.49,29.21 3.49,15.56 2.86,14.92 1.91,14.92 0.95,14.92 43.5,30.48 44.77,30.48 42.23,30.48 27.94,11.43 27.94,10.16 28.26,3.18 29.21,3.18 27.89,19.31 27.89,18.41 17.69,32.46 31.46,8.57 31.56,4.18 42.06,10.27 38.66,10.17 21.69,18.01 40.73,28.68 39.83,28.68 38.83,27.68 38.83,26.68 38.83,25.78 38.83,24.78 39.23,23.48 40.63,23.48 41.83,21.88 43.03,21.88 44.33,21.88 33.16,12.57 34.16,17.47 37.66,14.97 11.09,30.36 15.49,29.06 16.39,25.36 23.79,27.66 23.79,26.76 28.09,26.96 28.09,25.86 28.19,24.76 38.71,3.77 39.71,3.77 10.09,26.36 12.39,23.56 13.89,19.46 27.89,32.26 9.64,9.6 24.7,12.2 25.29,18.81 25.19,25.36 25.19,26.76 25.5,8.15 6.24,8.1 4.07,5.78
  pour Bottom: -2.22,15.24 -2.22,-2.86 57.15,-2.86 57.15,35.56 3.17,35.56 3.17,15.24
  pour Top: -3.81,19.05 -3.81,-4.13 59.37,-4.13 59.37,36.51 3.17,36.51 3.17,15.24 -2.86,15.24 -2.86,19.05
GPOUT
  Top 0.203: U1.12 23.08,6.77 23.35,6.77 24.3,7.72 R10.1
L_RST  (via drill 0.35)
  Top 0.152: U$14.15 6.7,20.05 6.9,19.85 8.14,19.85 8.34,20.05 8.34,21.13 8.48,21.28 9.13,21.28 10.51,22.66 v11,22.66 | v33.1,21.55 33.1,21.08 33.1,21.07 33.1,20.62 35.71,18.02 35.71,14.64 36.23,14.12 U$15.15
  Bottom 0.152: v11,22.66 11.45,22.66 13.71,22.66 14.02,22.36 14.86,22.36 15.27,22.77 16.53,22.77 16.83,22.47 17.07,22.47 18.66,24.07 24.94,24.07 26.27,22.73 27.9,22.73 28.24,23.07 30.23,23.07 31.04,22.26 31.65,22.26 31.75,22.35 32.29,22.35 v33.1,21.55
L_SS  (via drill 0.35)
  Top 0.152: U$14.41 v13.3,30.75 | v39.9,20.45 40.64,19.71 U$15.19
  Bottom 0.152: v39.9,20.45 39.9,20.35 35.53,24.72 35.53,30.41 35.18,30.77 24.18,30.77 23.24,31.71 22.48,31.71 21.52,30.75 v13.3,30.75
LED1
  Top 0.203: U$14.5 7.8,17.1 R16.2
LED2
  Top 0.203: U$14.2 4.5,16.6 R17.2
MISO
  Top 0.152: U$14.28 11.6,29.6 11.6,29.66 11.76,29.83 16.24,29.83 17.36,28.71 17.37,28.7 18.83,28.7 18.87,28.75 27.45,28.75 34.95,21.25 36.4,21.25 39.09,18.55 41.37,18.55 42.08,17.85 42.1,17.85 42.1,15.95 41.54,15.38 U$15.16
MOSI  (via drill 0.35)
  Top 0.152: U$14.30 13.3,24.49 14.29,23.5 16.57,23.5 17.37,24.29 22.06,24.29 25.4,20.95 28.37,20.95 29.23,20.1 29.23,19.35 v29.53,19.05 | U$15.17 39.23,16.66 v39.05,16.83
  Bottom 0.152: U$16.MOSI 29.53,15.05 v29.53,19.05 37.9,19.05 39.05,17.9 v39.05,16.83
N$1  (via drill 0.35)
  Top 0.203: v12.38,11.75 13.23,10.9
  Top 0.254: 13.23,10.9 13.97,10.9 R3.1
  Bottom 0.203: v12.38,11.75 11.11,11.75 10.16,10.8 9.21,10.8 8.89,10.48 8.89,9.52 6.71,7.35 5.4,7.35 4.53,8.22 3.73,8.22 3.67,8.16 D3.C 1.37,8.25
N$2
  Top 0.254: R12.2 37.15,5.29 R13.1 38.91,6.94 Q1.1
N$3
  Top 0.813: U$15.21 ANT.P
N$4  (via drill 0.35)
  Top 0.254: v36.51,9.84 37.78,8.57 40.01,8.57 41.1,7.47 42.58,7.47 R18.2
  Bottom 0.254: U$16.LEDK 35.26,11.1 v36.51,9.84
N$6
  Top 0.254: U$14.45 18.86,31.12 R14.2
N$7
  Top 0.254: U$14.46 19.51,29.25 R15.2
N$9  (via drill 0.35)
  Top 0.203: U$14.25 7.8,27.52 RXD.TP
  other vias: 7.73,27.45
N$10  (via drill 0.35)
  Top 0.152: U$14.16 7.73,20.66 TXD.TP
  other vias: 7.73,24.89
N$11
  Top 0.254: U3.1 14.07,12.7 R3.2
N$12
  Top 0.305: R4.1 8.36,12.7 U3.5
N$13  (via drill 0.35)
  Top 0.203: R16.1 6.35,16.05 v6.3,16.05
  Bottom 0.203: v6.3,16.05 6.3,16.55 6.73,16.98 6.73,22.72 5,24.45 5,26.8 D2.A
N$14  (via drill 0.35)
  Top 0.203: R17.1 4.7,14.55 v4.4,14.25
  Bottom 0.203: v4.4,14.25 5.1,14.95 D4.A
N$15
  Top 0.254: Q1.3 42.77,6.03 R18.1
NRF_RST  (via drill 0.35)
  Top 0.152: U$14.48 17.1,27.05 16.6,27.55 v16.6,27.84
  Bottom 0.152: v16.6,27.84 12.31,27.84 9.9,30.25 7.3,30.25 5.2,32.35 RST.TP
PHOLD  (via drill 0.35)
  Top 0.152: C1.1 21.59,16.16 21.2,16.55 17.13,16.55 16.83,16.85
  Top 0.254: R1.2 21.49,14.5 C1.1
  Top 0.305: v12.7,7.3 12.7,6.38 U2.3 | v16.83,16.83 16.83,16.85 16.83,17.87 U$14.13
  Bottom 0.305: v12.7,7.3 12.7,9.54 16.83,13.67 v16.83,16.83
PIEZO  (via drill 0.35)
  Top 0.305: U$14.14 5.6,22.25 PZ.TP
  other vias: 5.1,22.75
RXEN  (via drill 0.35)
  Top 0.152: 15.6,18.2 U$14.12 15.5,19.13 15.72,19.35 15.76,19.39 17.37,20.99 18.83,20.99 19.07,20.75 22.75,20.75 23.48,20.02 23.48,18.27 24.7,17.05 v24.74,17.05 | v27.7,17.15 27.21,16.66 U$15.6
  Bottom 0.152: v24.74,17.05 27.6,17.05 v27.7,17.15
SCK  (via drill 0.35)
  Top 0.152: v30.48,17.78 29.82,18.44 29.28,18.44 28.92,18.8 28.92,19.97 28.25,20.65 25.27,20.65 22.43,23.5 19.12,23.5 18.83,23.2 16.71,23.2 16.7,23.19 14.16,23.19 12.99,24.36 12.99,24.45 12.99,25.74 12.2,26.54 U$14.29 | U$15.18 37,17.93 v36.83,18.1
  Bottom 0.152: U$16.SCK 30.48,15.05 v30.48,17.78 30.8,18.1 v36.83,18.1
SCL  (via drill 0.35)
  Top 0.152: v22.86,11.19 21.03,11.19 20.77,11.44 18.93,11.44 17.49,12.89 17.49,15 17.13,15.35 13.66,15.35 11.65,17.37 11.65,18.82 11.51,18.96 10.53,18.96 10.13,19.37 9.21,19.37 8.9,19.68 U$14.17
  Top 0.2: JP7.2 18.1,1.59 R6.1
  Top 0.203: U1.2 22.24,10.28 22.24,10.76 22.39,10.91 22.58,10.91 v22.86,11.19
  Bottom 0.203: JP7.2 17.94,1.75 | 17.94,1.75 18.41,2.22 | v22.86,11.19 22.15,11.19 21.59,11.75 19.68,11.75 15.88,7.94 15.88,3.81 17.94,1.75
SDA  (via drill 0.35)  (1 unrouted)
  Top 0.152: v23.45,10.21 23.45,10.48 23.59,10.48 24.2,11.08 24.74,11.08 25.45,11.8 25.49,11.84 25.5,11.85 25.5,17.14 24.99,17.65 24.52,17.65 23.79,18.39 23.79,20.15 22.88,21.06 22.85,21.06 21.37,22.54 18.2,22.54 U$14.52
  Top 0.2: R9.1 16.51,3.91 16.51,3.18 15.24,1.9 JP7.1
  Top 0.203: v23.45,10.21 22.61,10.21 U1.1
  Bottom 0.203: v23.45,10.21 23.45,10.88 23.49,10.92 23.49,11.45 23.12,11.82 22.6,11.82 22.54,11.75 22.09,11.75 21.74,12.1 19.54,12.1 15.28,7.84 15.28,4.3 15.24,4.26 JP7.1
SWCLK  (via drill 0.35)
  Top 0.254: 9.91,32.51 v10.16,32.76 10,32.6 U$14.38
  Bottom 0.254: TP2.TP v10.16,32.76
SWDIO  (via drill 0.35)
  Top 0.254: U$14.37 8.89,32.38 8.51,32.76 v8.26,32.76
  Bottom 0.254: v8.26,32.76 8,32.76 TP1.TP
SWITCH
  Top 0.203: U$14.39 11.1,32.51 11.75,33.16 21.97,33.16 U$19.1
TS
  Top 0.203: U1.10 21.79,5.57 22.23,5.13 22.66,5.13 23.24,4.55 R11.2
TXEN  (via drill 0.35)
  Top 0.152: U$14.10 13.3,17.35 13.6,17.05 15.73,17.05 16.05,17.37 16.05,18.83 16.18,18.96 17.01,18.96 18.84,17.13 21.89,17.13 v22.57,16.45
  Bottom 0.152: U$15.7 26.08,15.95 23.07,15.95 v22.57,16.45
  other vias: 26.64,15.38
USB_N  (via drill 0.35)
  Top 0.152: 21.8,29.84 R15.1
  Top 0.254: 6.35,9.73 v6.35,9.98 6.23,9.86 JP1.D-1 | v22.86,29.84 21.8,29.84
  Bottom 0.254: v6.35,9.98 6.35,9.73 7.22,9.73 7.42,9.93 7.42,21.67 12.41,26.87 21.19,26.87 23.61,29.29 23.61,29.76 23.35,30.02 23.03,30.02 v22.86,29.84
USB_P  (via drill 0.35)
  Top 0.152: 4.74,9.32 JP1.D+1 | 21.8,30.8 R14.1
  Top 0.254: 6.35,9.32 v6.35,9.07 6.21,9.21 JP1.D+1 | v22.86,30.8 21.8,30.8
  Bottom 0.152: 23.15,30.8 v22.86,30.8
  Bottom 0.254: v6.35,9.07 6.35,9.32 7.39,9.32 7.82,9.76 7.82,20.65 7.82,21.51 12.67,26.47 21.36,26.47 24.02,29.13 24.02,29.93 23.15,30.8
VBAT
  Top 0.203: U1.7 20.59,5.35 19.84,4.61 19.84,4.44 19.84,4.29
  Top 0.305: 19.84,4.29 R5.2 | 19.84,4.44 19.84,6.68 19.23,7.3 17.45,7.3 17.4,7.35 15.1,7.35 12.92,9.52 Q3.3 12.38,9.57 12.38,10.16 11.11,11.43 11.11,14.29 11.43,14.6 U3.3
  Top 0.406: C9.2 15.87,14.92 12.73,14.92 U3.3
VBUS  (via drill 0.35)  (1 unrouted)
  Top 0.152: R2.2 v6.03,11.75 6.03,11.11
  Top 0.203: U$14.47 18.2,28.15 | 19.8,28.15 C10.2
  Top 0.254: JP1.VBUS1 4.79,10.51 | 9.69,15.4 v10.16,15.87 v10.16,15.88 | v14.61,25.08 15.56,26.04 15.56,27.62 15.94,28.01 15.94,28.11 16.33,28.49 16.87,28.49 17.22,28.15 18.2,28.15 | U$14.47 18.21,28.26
  Top 0.406: D1.A 7.62,11.9 7.4,12.12 7.4,15.19 7.61,15.4 9.69,15.4 9.84,15.24 9.74,15.14 9.74,14.67 U3.4 | 18.2,28.15 19.8,28.15
  Top 0.508: 4.79,10.51 5.4,11.11 6.03,11.11 7.57,11.11 D1.A 9.26,11.06 9.85,10.48
  Bottom 0.203: D3.A 3.67,10.26 3.73,10.2 4.49,10.2 v6.03,11.75
  Bottom 0.254: v14.61,25.08 12.38,25.08 9.53,22.22 9.53,16.51 v10.16,15.88
VHI  (via drill 0.35)
  Top 0.152: v34.92,30.16 34.22,30.87 U$17.2 | D1.C 7.19,7.36 v6.26,6.43
  Top 0.203: v34.92,30.16 34.72,30.37
  Top 0.406: C7.2 U2.1 12.06,4.45 11.11,5.4 11.11,7.89 Q3.2
  Top 0.508: D1.C 7.67,7.36 8.89,8.57 Q3.2
  Bottom 0.152: v6.26,6.43 1.8,6.43 0.76,7.46 0.76,8.85 0.89,8.99 4.5,8.99 7.06,11.55 7.06,22.02 12.16,27.12 12.24,27.21 12.26,27.23 12.27,27.23 12.41,27.23 12.55,27.23 12.56,27.23 21.04,27.23 22.25,28.44 22.25,31.05 22.61,31.4 23.11,31.4 24.35,30.16 v34.92,30.16
(copper drawn outside any net)
  shapes: Top area x2

### Text on the board
bPlace: GND | SWD | SWC | 3V3 | SX1262 LoRa Relay | GND | 3V3 | SDA | SCL | BAT | GND